# EAGLE design Arduino Mega DRAM Tester Shield (EAGLE 9.5.2)
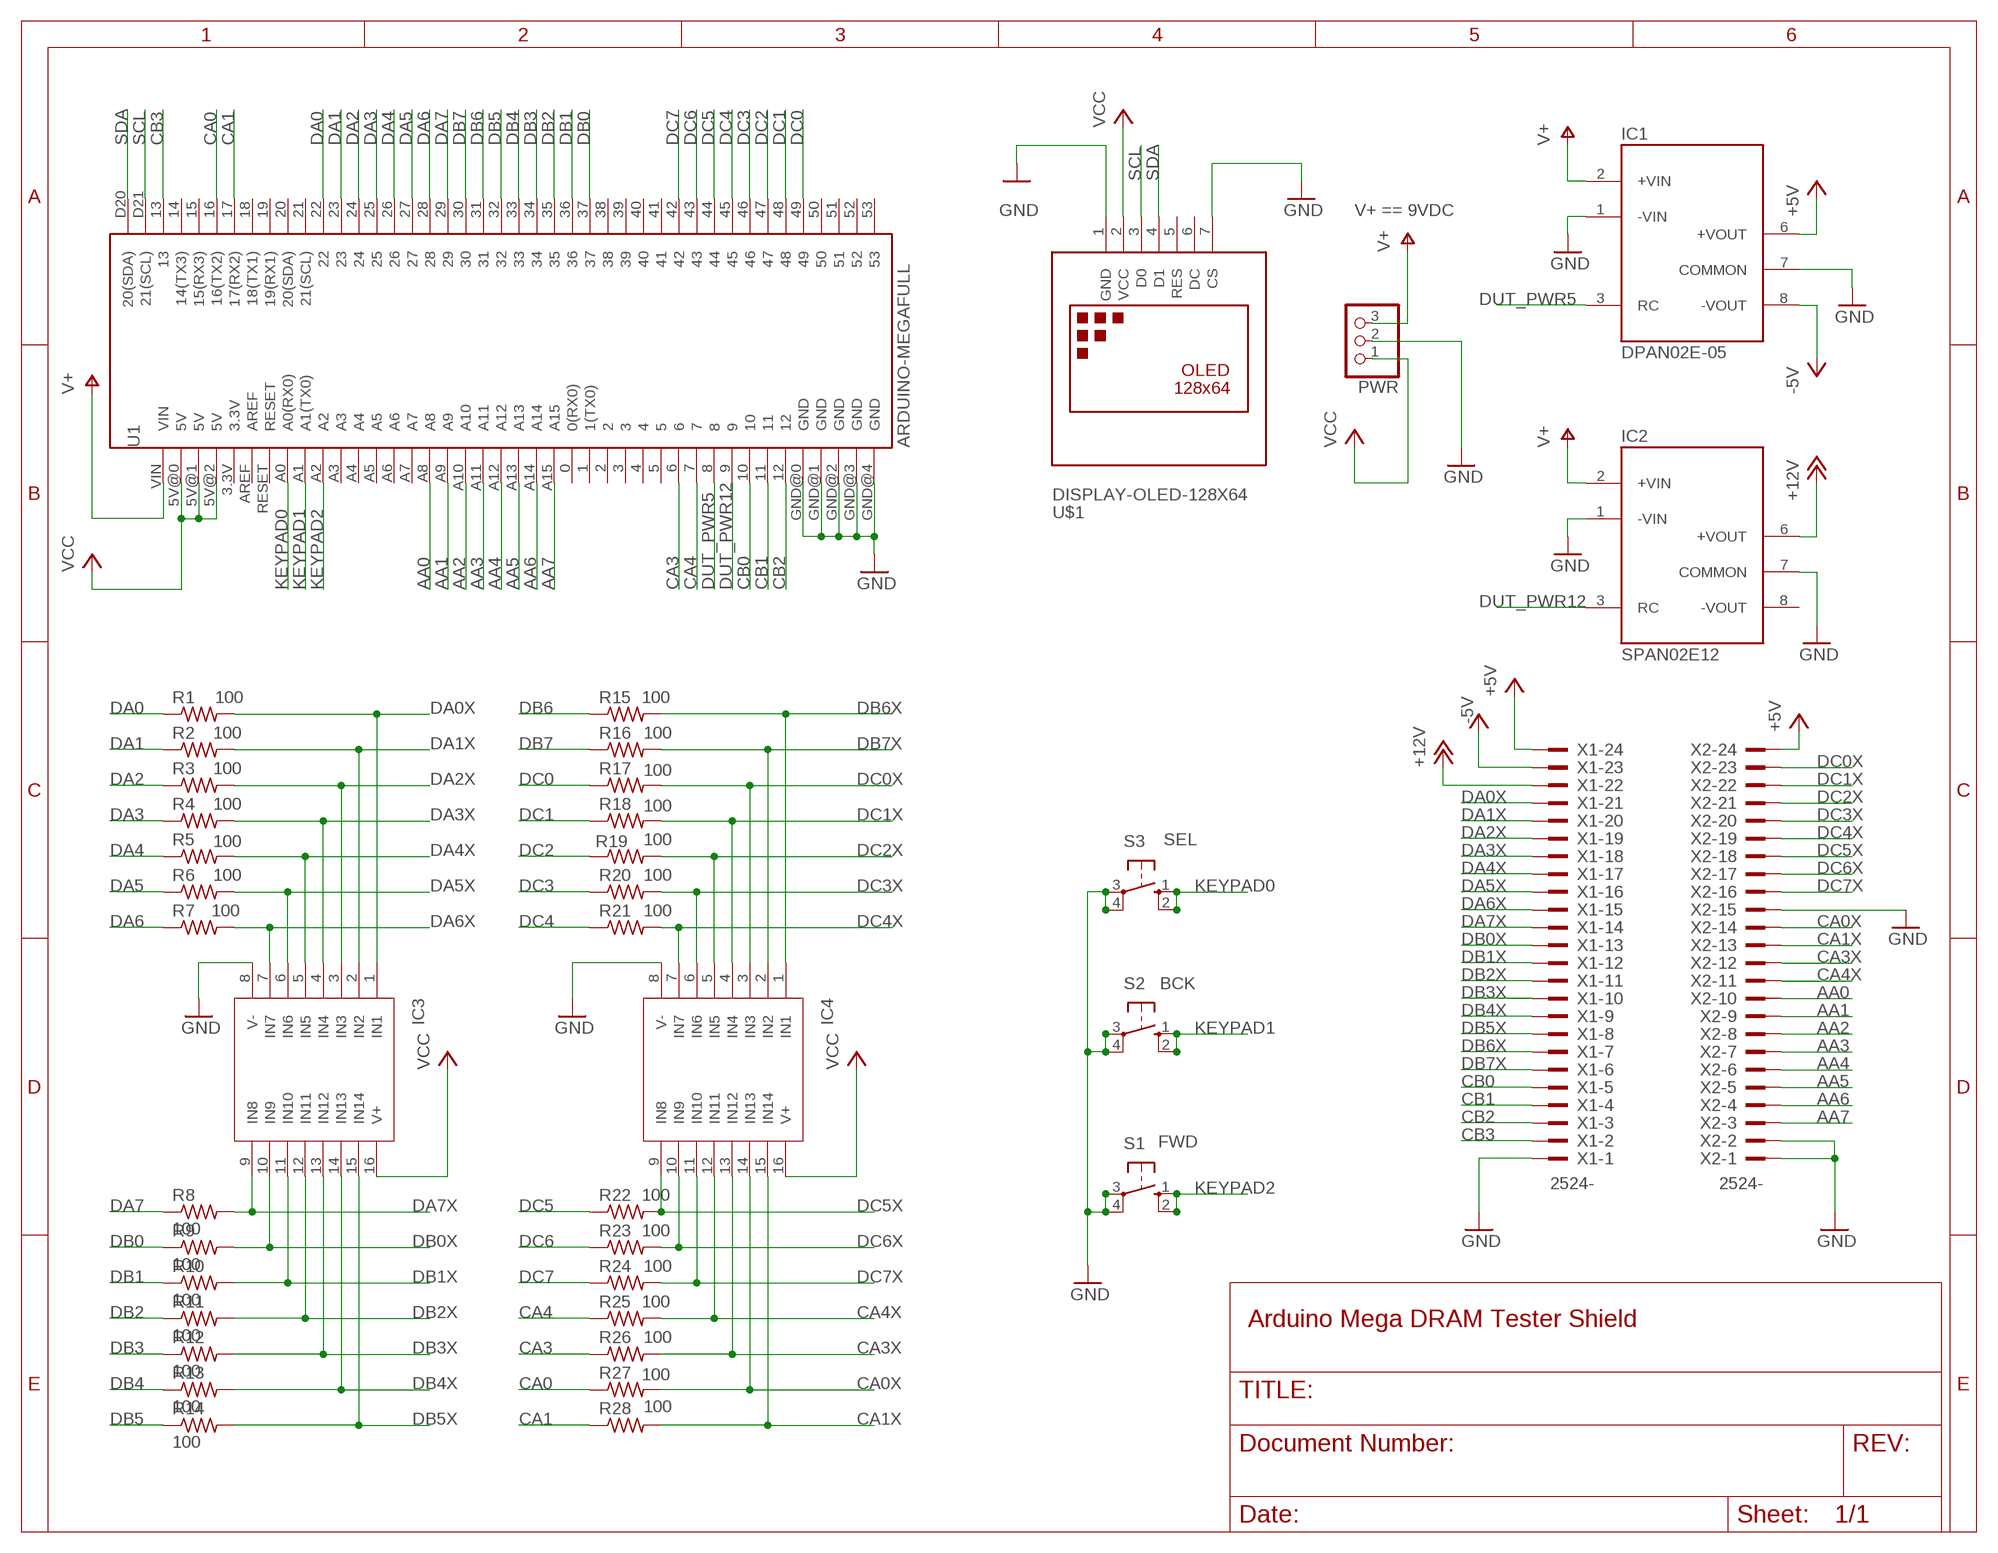
[diagram p0: schematic, sheet 1]

## Parts
IC1  DPAN02E-05  DPAN02  [SIP7]
IC2  SPAN02E12  DPAN02  [SIP7]
IC3  SP720  [DIL16]
IC4  SP720  [DIL16]
PWR  PINHD-1X3  [1X03]
R1  100  R-US_0204/7  [0204/7]
R2  100  R-US_0204/7  [0204/7]
R3  100  R-US_0204/7  [0204/7]
R4  100  R-US_0204/7  [0204/7]
R5  100  R-US_0204/7  [0204/7]
R6  100  R-US_0204/7  [0204/7]
R7  100  R-US_0204/7  [0204/7]
R8  100  R-US_0204/7  [0204/7]
R9  100  R-US_0204/7  [0204/7]
R10  100  R-US_0204/7  [0204/7]
R11  100  R-US_0204/7  [0204/7]
R12  100  R-US_0204/7  [0204/7]
R13  100  R-US_0204/7  [0204/7]
R14  100  R-US_0204/7  [0204/7]
R15  100  R-US_0204/7  [0204/7]
R16  100  R-US_0204/7  [0204/7]
R17  100  R-US_0204/7  [0204/7]
R18  100  R-US_0204/7  [0204/7]
R19  100  R-US_0204/7  [0204/7]
R20  100  R-US_0204/7  [0204/7]
R21  100  R-US_0204/7  [0204/7]
R22  100  R-US_0204/7  [0204/7]
R23  100  R-US_0204/7  [0204/7]
R24  100  R-US_0204/7  [0204/7]
R25  100  R-US_0204/7  [0204/7]
R26  100  R-US_0204/7  [0204/7]
R27  100  R-US_0204/7  [0204/7]
R28  100  R-US_0204/7  [0204/7]
S1  FWD  10-XX  [B3F-10XX]
S2  BCK  10-XX  [B3F-10XX]
S3  SEL  10-XX  [B3F-10XX]
U1  ARDUINO-MEGAFULL  [ARDUINO_MEGA]
U$1  DISPLAY-OLED-128X64  [DISPLAY-OLED-128X64]
X1  2524-  [PAK100/2500-24]
X2  2524-  [PAK100/2500-24]

## Nets
+5V: IC1.6(+VOUT) X1.24 X2.24
+12V: IC2.6(+VOUT) X1.22
-5V: IC1.8(-VOUT) X1.23
AA0: U1.A8 X2.10
AA1: U1.A9 X2.9
AA2: U1.A10 X2.8
AA3: U1.A11 X2.7
AA4: U1.A12 X2.6
AA5: U1.A13 X2.5
AA6: U1.A14 X2.4
AA7: U1.A15 X2.3
CA0: R27.1 U1.16(16(TX2))
CA0X: IC4.14(IN13) R27.2 X2.14
CA1: R28.1 U1.17(17(RX2))
CA1X: IC4.15(IN14) R28.2 X2.13
CA3: R26.1 U1.6
CA3X: IC4.13(IN12) R26.2 X2.12
CA4: R25.1 U1.7
CA4X: IC4.12(IN11) R25.2 X2.11
CB0: U1.10 X1.5
CB1: U1.11 X1.4
CB2: U1.12 X1.3
CB3: U1.13 X1.2
DA0: R1.1 U1.22
DA0X: IC3.1(IN1) R1.2 X1.21
DA1: R2.1 U1.23
DA1X: IC3.2(IN2) R2.2 X1.20
DA2: R3.1 U1.24
DA2X: IC3.3(IN3) R3.2 X1.19
DA3: R4.1 U1.25
DA3X: IC3.4(IN4) R4.2 X1.18
DA4: R5.1 U1.26
DA4X: IC3.5(IN5) R5.2 X1.17
DA5: R6.1 U1.27
DA5X: IC3.6(IN6) R6.2 X1.16
DA6: R7.1 U1.28
DA6X: IC3.7(IN7) R7.2 X1.15
DA7: R8.1 U1.29
DA7X: IC3.9(IN8) R8.2 X1.14
DB0: R9.1 U1.37
DB0X: IC3.10(IN9) R9.2 X1.13
DB1: R10.1 U1.36
DB1X: IC3.11(IN10) R10.2 X1.12
DB2: R11.1 U1.35
DB2X: IC3.12(IN11) R11.2 X1.11
DB3: R12.1 U1.34
DB3X: IC3.13(IN12) R12.2 X1.10
DB4: R13.1 U1.33
DB4X: IC3.14(IN13) R13.2 X1.9
DB5: R14.1 U1.32
DB5X: IC3.15(IN14) R14.2 X1.8
DB6: R15.1 U1.31
DB6X: IC4.1(IN1) R15.2 X1.7
DB7: R16.1 U1.30
DB7X: IC4.2(IN2) R16.2 X1.6
DC0: R17.1 U1.49
DC0X: IC4.3(IN3) R17.2 X2.23
DC1: R18.1 U1.48
DC1X: IC4.4(IN4) R18.2 X2.22
DC2: R19.1 U1.47
DC2X: IC4.5(IN5) R19.2 X2.21
DC3: R20.1 U1.46
DC3X: IC4.6(IN6) R20.2 X2.20
DC4: R21.1 U1.45
DC4X: IC4.7(IN7) R21.2 X2.19
DC5: R22.1 U1.44
DC5X: IC4.9(IN8) R22.2 X2.18
DC6: R23.1 U1.43
DC6X: IC4.10(IN9) R23.2 X2.17
DC7: R24.1 U1.42
DC7X: IC4.11(IN10) R24.2 X2.16
DUT_PWR5: IC1.3(RC) U1.8
DUT_PWR12: IC2.3(RC) U1.9
GND: IC1.1(-VIN) IC1.7(COMMON) IC2.1(-VIN) IC2.7(COMMON) IC3.8(V-) IC4.8(V-) PWR.2 S1.3(P) S1.4(P1) S2.3(P) S2.4(P1) S3.3(P) S3.4(P1) U1.GND@0(GND) U1.GND@1(GND) U1.GND@2(GND) U1.GND@3(GND) U1.GND@4(GND) U$1.1(GND) U$1.7(CS) X1.1 X2.1 X2.2 X2.15
KEYPAD0: S3.1(S) S3.2(S1) U1.A0(A0(RX0))
KEYPAD1: S2.1(S) S2.2(S1) U1.A1(A1(TX0))
KEYPAD2: S1.1(S) S1.2(S1) U1.A2
SCL: U1.D21(21(SCL)) U$1.3(D0)
SDA: U1.D20(20(SDA)) U$1.4(D1)
V+: IC1.2(+VIN) IC2.2(+VIN) PWR.3 U1.VIN
VCC: IC3.16(V+) IC4.16(V+) PWR.1 U1.5V@0(5V) U1.5V@1(5V) U1.5V@2(5V) U$1.2(VCC)
Unconnected: IC2.8(-VOUT) U1.0(0(RX0)) U1.1(1(TX0)) U1.2 U1.3 U1.3.3V U1.4 U1.5 U1.14(14(TX3)) U1.15(15(RX3)) U1.18(18(TX1)) U1.19(19(RX1)) U1.20(20(SDA)) U1.21(21(SCL)) U1.38 U1.39 U1.40 U1.41 U1.50 U1.51 U1.52 U1.53 U1.A3 U1.A4 U1.A5 U1.A6 U1.A7 U1.AREF U1.RESET U$1.5(RES) U$1.6(DC)

## Notes on the sheet
- V+ == 9VDC

## Library data of the parts
IC1 IC2 = MW DPAN02:DPAN02
IC3 IC4 = Littlefuse:SP720
PWR = pinhead:PINHD-1X3: PIN HEADER
R1-R28 = resistor:R-US_: RESISTOR, American symbol
S1-S3 = switch-omron:10-XX: OMRON SWITCH; MPN: B3F-1000; OC_FARNELL: 176432; OC_NEWARK: 36M3542
U1 = SparkFun-Boards:ARDUINO-MEGA: Arduino Mega board footprint
U$1 = Soigeneris:DISPLAY-OLED-128X64: 128x64 Dot Matrix OLED Module based on SSD1306 chip Variant with SPI interface More details available here: http://www.instructables.com/id/How-to-use-OLED-display-arduino-module/ SSD1306 datasheet: https://cdn-shop.adafruit.com/datasheets/SSD1306.pdf Click here to find device on ebay.com <http://www.ebay.com/sch/oled+display+128x64> Note: There are two variants: I2C and SPI. Search for the proper version.
X1 X2 = con-3m:2524-: 3M (TM) Pak 100 4-Wall Header Source: 3M; OC_FARNELL: unknown; OC_NEWARK: unknown

## Board
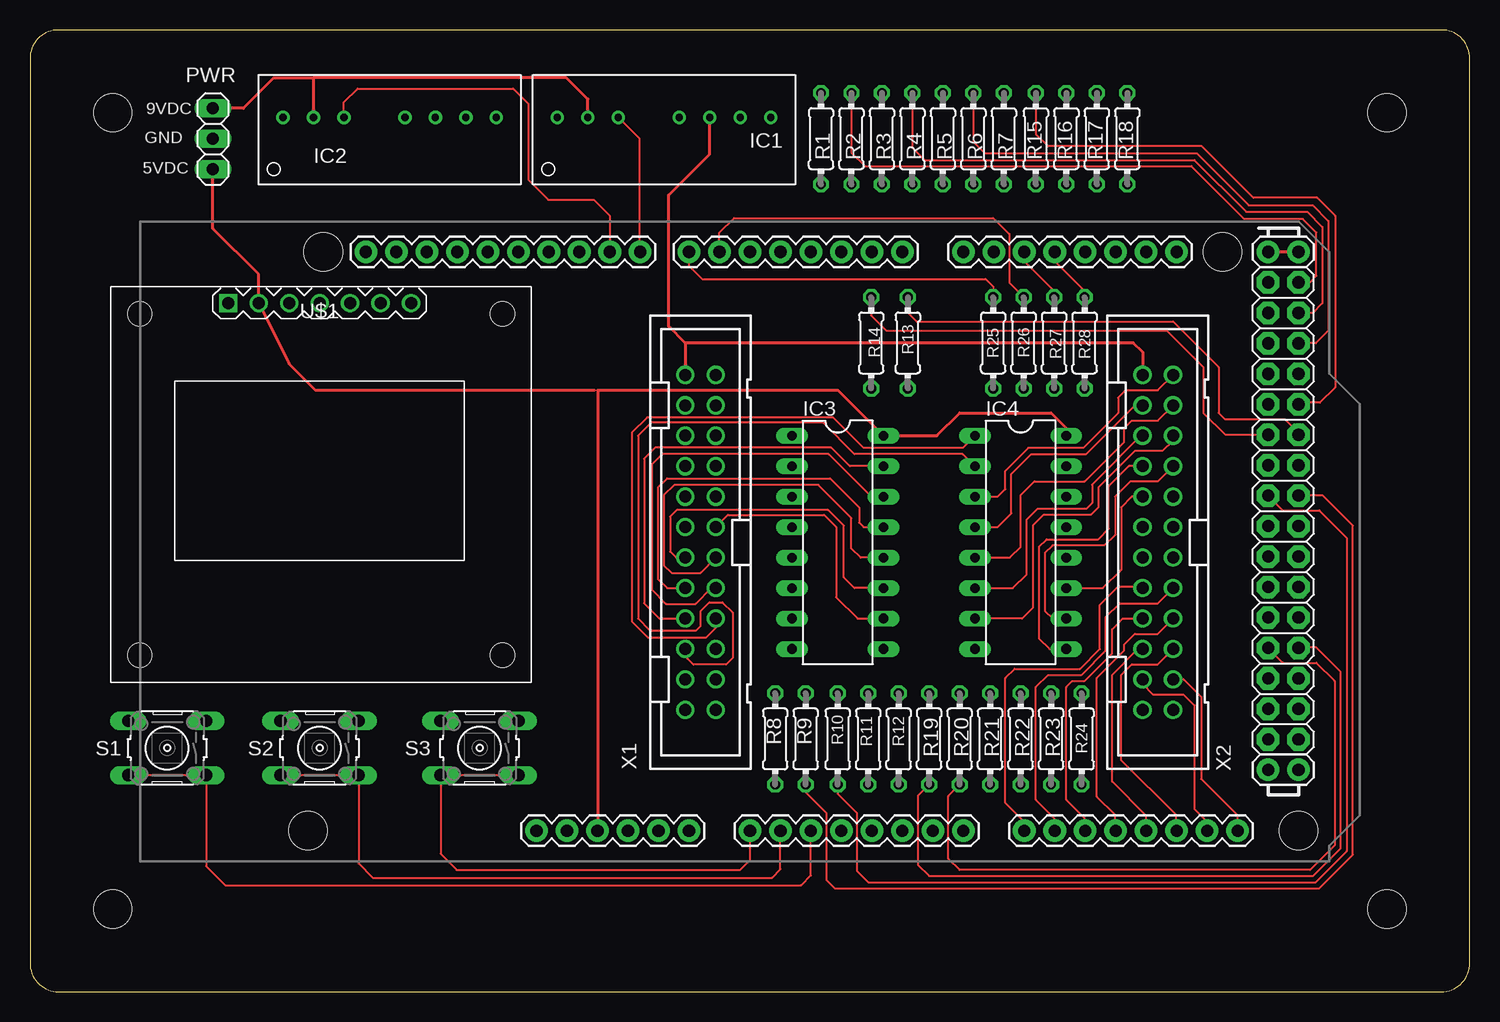
[diagram p1: board, top side]
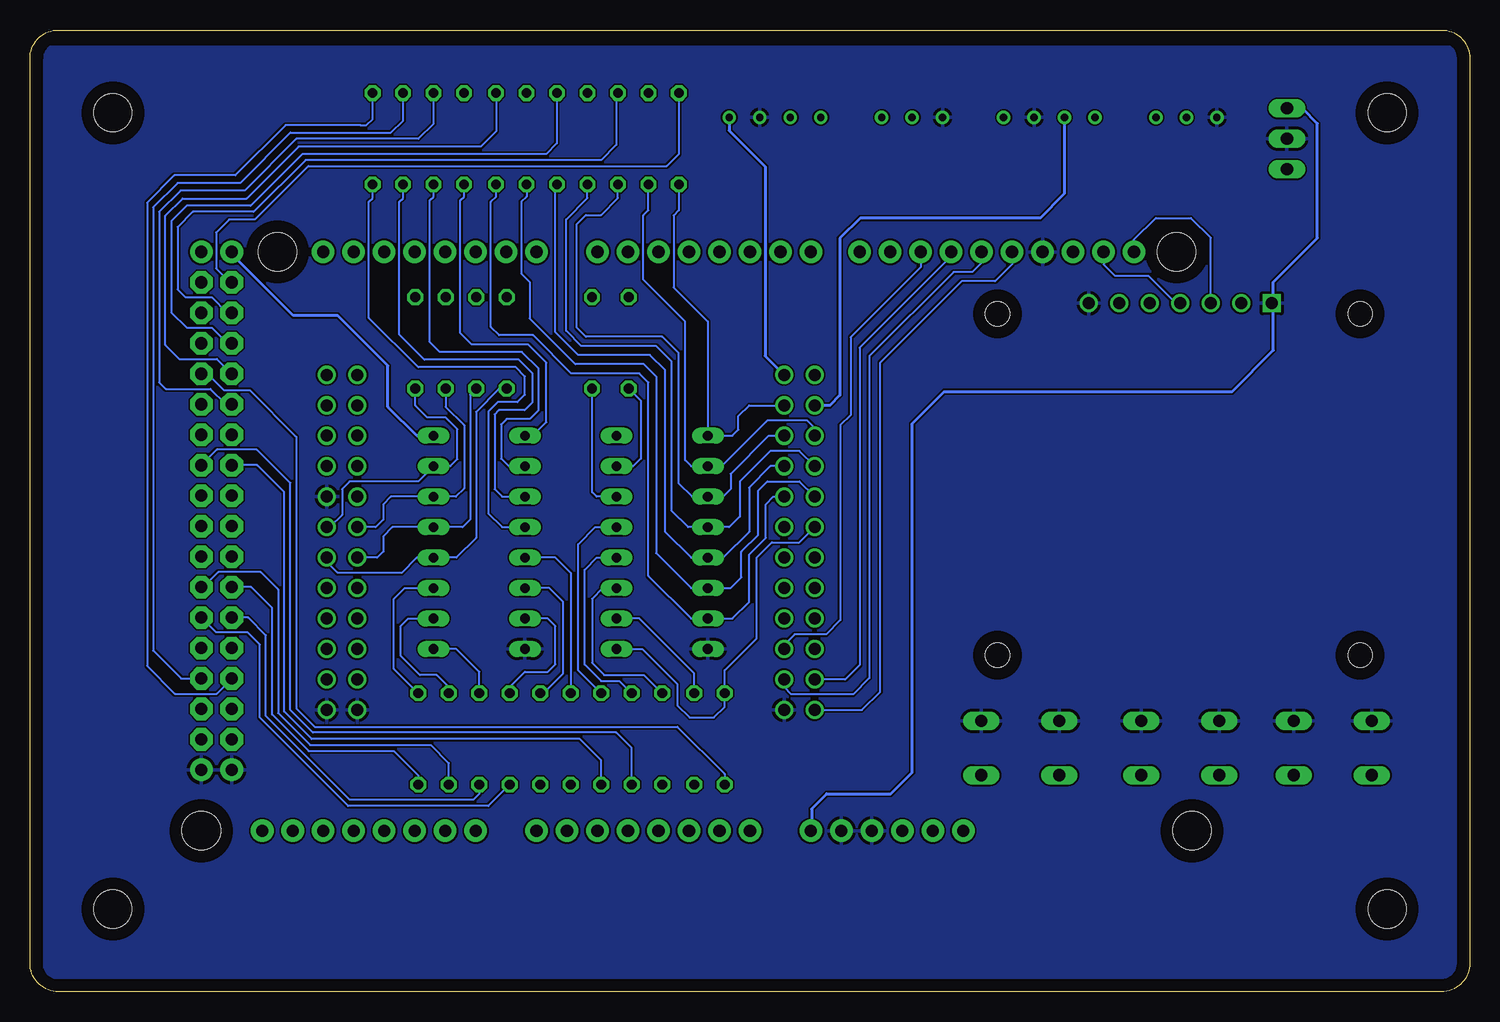
[diagram p2: board, bottom side, seen from below]

Size 119.99 x 80.19 mm. Coordinates in mm from the lower left corner, seen from the top.
Outline: 0,77.81 0,2.38 arc90 2.38,0 117.61,0 arc90 119.99,2.38 119.99,77.81 arc90 117.61,80.19 2.38,80.19 arc90 0,77.81
Copper layers (1*16): Top 0.035mm / dielectric 1.5mm / Bottom 0.035mm
Design rules "default": minimum track width 6mil, minimum drill 0.35mm, track to track 6mil, track to pad 6mil, pad to pad 6mil, via to via 6mil, smd to smd 6mil, copper to edge 40mil, drill to drill 6mil, minimum pad ring 10mil, minimum via ring 8mil, stop-mask expansion 4mil, vias tented up to drill 0mil, thermal gap 10mil
Holes 3.17 mm at 6.89,73.29 113.09,73.29 113.09,6.89 6.89,6.89

### Footprints (pad centres in the part's own frame; a part is rotated, then mirrored left to right if it is on the bottom)
SIP7 = drill 0.6: 1 2.032,5.588; 2 4.572,5.588; 3 7.112,5.588; 5 12.192,5.588; 6 14.732,5.588; 7 17.272,5.588; 8 19.812,5.588
DIL16 = drill 0.813 long: 1 -8.89,-3.81; 2 -6.35,-3.81; 3 -3.81,-3.81; 4 -1.27,-3.81; 5 1.27,-3.81; 6 3.81,-3.81; 7 6.35,-3.81; 8 8.89,-3.81; 9 8.89,3.81; 10 6.35,3.81; 11 3.81,3.81; 12 1.27,3.81; 13 -1.27,3.81; 14 -3.81,3.81; 15 -6.35,3.81; 16 -8.89,3.81
1X03 = drill 1.016 long: 1 -2.54,0; 2 0,0; 3 2.54,0
0204/7 = drill 0.813 octagon: 1 -3.81,0; 2 3.81,0
B3F-10XX = drill 1.016 long: 1 -3.251,2.261; 2 3.251,2.261; 3 -3.251,-2.261; 4 3.251,-2.261
ARDUINO_MEGA = drill 1.016 pad 1.88: 0 63.5,50.8; 1 60.96,50.8; 2 58.42,50.8; 3 55.88,50.8; 3.3V 35.56,2.54; 4 53.34,50.8; 5 50.8,50.8; 5V@0 38.1,2.54; 5V@1 93.98,50.8; 5V@2 96.52,50.8; 6 48.26,50.8; 7 45.72,50.8; 8 41.656,50.8; 9 39.116,50.8; 10 36.576,50.8; 11 34.036,50.8; 12 31.496,50.8; 13 28.956,50.8; 14 68.58,50.8; 15 71.12,50.8; 16 73.66,50.8; 17 76.2,50.8; 18 78.74,50.8; 19 81.28,50.8; 20 83.82,50.8; 21 86.36,50.8; A0 50.8,2.54; A1 53.34,2.54; A2 55.88,2.54; A3 58.42,2.54; A4 60.96,2.54; A5 63.5,2.54; A6 66.04,2.54; A7 68.58,2.54; A8 73.66,2.54; A9 76.2,2.54; A10 78.74,2.54; A11 81.28,2.54; A12 83.82,2.54; A13 86.36,2.54; A14 88.9,2.54; A15 91.44,2.54; AREF 23.876,50.8; D20 21.336,50.8; D21 18.796,50.8; GND@0 40.64,2.54; GND@1 43.18,2.54; GND@2 93.98,7.62; GND@3 96.52,7.62; GND@4 26.416,50.8; RESET 33.02,2.54; VIN 45.72,2.54 | drill 1.016 pad 1.88 octagon: 22 93.98,48.26; 23 96.52,48.26; 24 93.98,45.72; 25 96.52,45.72; 26 93.98,43.18; 27 96.52,43.18; 28 93.98,40.64; 29 96.52,40.64; 30 93.98,38.1; 31 96.52,38.1; 32 93.98,35.56; 33 96.52,35.56; 34 93.98,33.02; 35 96.52,33.02; 36 93.98,30.48; 37 96.52,30.48; 38 93.98,27.94; 39 96.52,27.94; 40 93.98,25.4; 41 96.52,25.4; 42 93.98,22.86; 43 96.52,22.86; 44 93.98,20.32; 45 96.52,20.32; 46 93.98,17.78; 47 96.52,17.78; 48 93.98,15.24; 49 96.52,15.24; 50 93.98,12.7; 51 96.52,12.7; 52 93.98,10.16; 53 96.52,10.16 | hole 3.2: 15.24,50.8; 13.97,2.54; 90.17,50.8; 96.52,2.54
DISPLAY-OLED-128X64 = drill 1 square: 1 -7.62,15.24 | drill 1: 2 -5.08,15.24; 3 -2.54,15.24; 4 0,15.24; 5 2.54,15.24; 6 5.08,15.24; 7 7.62,15.24 | hole 2: -14.986,14.351; 15.24,14.351; 15.24,-14.097; -14.986,-14.097
PAK100/2500-24 = drill 1 pad 1.422: 1 -13.97,-1.27; 2 -13.97,1.27; 3 -11.43,-1.27; 4 -11.43,1.27; 5 -8.89,-1.27; 6 -8.89,1.27; 7 -6.35,-1.27; 8 -6.35,1.27; 9 -3.81,-1.27; 10 -3.81,1.27; 11 -1.27,-1.27; 12 -1.27,1.27; 13 1.27,-1.27; 14 1.27,1.27; 15 3.81,-1.27; 16 3.81,1.27; 17 6.35,-1.27; 18 6.35,1.27; 19 8.89,-1.27; 20 8.89,1.27; 21 11.43,-1.27; 22 11.43,1.27; 23 13.97,-1.27; 24 13.97,1.27

### Placement (x,y rotation side)
IC1  41.91,67.31 0 top
IC2  19.05,67.31 0 top
IC3  67.31,37.47 270 top
IC4  82.55,37.47 270 top
PWR  15.24,71.12 90 top
R1  65.91,71.12 270 top
R2  68.45,71.12 270 top
R3  70.99,71.12 270 top
R4  73.53,71.12 270 top
R5  76.07,71.12 270 top
R6  78.61,71.12 270 top
R7  81.15,71.12 270 top
R8  62.1,21.08 90 top
R9  64.64,21.08 90 top
R10  67.31,21.08 90 top
R11  69.85,21.08 90 top
R12  72.39,21.08 90 top
R13  73.15,54.1 270 top
R14  70.1,54.1 270 top
R15  83.82,71.12 270 top
R16  86.36,71.12 270 top
R17  88.9,71.12 270 top
R18  91.44,71.12 270 top
R19  74.93,21.08 90 top
R20  77.47,21.08 90 top
R21  80.01,21.08 90 top
R22  82.55,21.08 90 top
R23  85.09,21.08 90 top
R24  87.63,21.08 90 top
R25  80.26,54.1 270 top
R26  82.8,54.1 270 top
R27  85.34,54.1 270 top
R28  87.88,54.1 270 top
S1  11.43,20.32 180 top
S2  24.13,20.32 180 top
S3  37.47,20.32 180 top
U1  9.19,10.88 0 top
U$1  24.13,42.16 0 top
X1  55.88,37.47 90 top
X2  93.98,37.47 90 top

### Tracks (layer width: path | path; a pad name or v marks a point on that pad's centre or on a via)
+5V
  Top 0.254: 54.61,54.1 X1.24 | X2.24 92.71,53.34 91.95,54.1 54.61,54.1 | IC1.6 56.64,69.85 53.21,66.42 53.21,55.5 54.61,54.1
+12V
  Bottom 0.254: IC2.6 33.78,66.55 35.81,64.52 50.8,64.52 52.5,62.81 52.5,49.73 53.34,48.9 X1.22
-5V
  Bottom 0.254: X1.23 58.73,53.01 58.73,68.8 61.72,71.8 IC1.8
AA0
  Top 0.152: U1.A8 82.86,14.17 81.28,15.75 81.28,26.16 82.04,26.92 87.5,26.92 89.15,28.57 89.15,32.26 90.68,33.78 92.58,33.78 X2.10
AA1
  Top 0.152: U1.A9 85.39,14.43 83.82,16 83.82,25.4 84.84,26.42 87.63,26.42 89.66,28.45 89.66,31.24 90.81,32.38 93.98,32.38 X2.9
AA2
  Top 0.152: U1.A10 87.88,13.47 87.88,14.48 86.36,16 86.36,25.4 86.87,25.91 87.88,25.91 90.17,28.19 90.17,30.23 91.06,31.11 X2.8
AA3
  Top 0.152: U1.A11 90.42,13.47 90.42,14.73 88.9,16.26 88.9,26.16 91.19,28.45 91.19,28.96 92.08,29.84 93.98,29.84 X2.7
AA4
  Top 0.152: U1.A12 93.02,14.68 90.17,17.53 90.17,26.42 92.33,28.57 X2.6
AA5
  Top 0.152: U1.A13 95.5,13.47 95.5,14.73 90.93,19.3 90.93,26.42 91.82,27.3 93.98,27.3 X2.5
AA6
  Top 0.152: U1.A14 98.09,14.19 97.03,15.25 97.03,23.88 96.14,24.77 93.6,24.77 92.71,25.65 X2.4
AA7
  Top 0.152: U1.A15 100.64,14.69 97.59,17.74 97.59,24.59 96.14,26.04 X2.3
CA0
  Top 0.152: U1.16 82.86,60.88 82.87,60.9 85.34,58.42 R27.1
CA0X
  Bottom 0.152: R27.2 85.34,48.77 83.82,47.24 83.82,41.96 84.51,41.27 IC4.14 89.92,41.27 90.55,40.64 90.55,39.37 91.19,38.73 X2.14
CA1
  Top 0.152: U1.17 85.39,60.91 87.88,58.42 R28.1
CA1X
  Bottom 0.152: R28.2 87.88,48.9 86.87,47.88 85.34,47.88 84.38,46.91 84.38,44.4 84.96,43.81 IC4.15 87.63,42.55 93.34,42.55 93.98,41.91 93.98,39.75 95,38.73 X2.13
CA3
  Top 0.152: R26.1 81.61,59.11 81.61,63.17 80.26,64.52 58.67,64.52 57.45,63.3 U1.6
CA3X
  Bottom 0.152: R26.2 83.31,49.78 83.31,39.37 83.95,38.73 IC4.13 89.79,38.73 90.55,37.97 90.55,36.7 91.06,36.2 X2.12
CA4
  Top 0.152: U1.7 54.91,60.53 56.01,59.44 79.63,59.44 80.26,58.8 R25.1
CA4X
  Bottom 0.152: R25.2 80.89,50.29 82.8,48.35 82.8,37.85 84.45,36.2 IC4.12 87.76,36.2 89.03,34.92 94.36,34.92 95.25,35.81 X2.11
CB0
  Bottom 0.152: U1.10 45.77,60.41 51.61,54.57 51.61,48.08 52.45,47.24 52.45,30.99 53.63,29.81 56.26,29.81 57.15,28.92 X1.5
CB1
  Bottom 0.152: U1.11 43.23,61.33 50.86,53.7 50.86,27.25 52.07,26.04 X1.4
CB2
  Bottom 0.152: X1.3 57.15,25.4 56.55,24.8 51.4,24.8 50.04,26.16 50.04,53 43.03,60 41.47,60 40.69,60.78 U1.12
CB3
  Bottom 0.152: U1.13 38.15,60.66 39.56,59.24 42.36,59.24 49.15,52.45 49.15,25.02 50.67,23.5 X1.2
DA0
  Bottom 0.152: R1.1 65.91,69.85 66.93,68.83 96.79,68.83 101.25,64.38 103.41,64.38 104.47,63.31 104.47,60.31 103.3,59.14 U1.22
DA0X
  Bottom 0.152: X1.21 60.07,48.9 60.96,48.01 60.96,46.86 61.47,46.35 IC3.1 63.5,55.88 66.34,58.73 66.34,64.72 65.91,65.15 R1.2
DA1
  Top 0.152: R2.1 68.45,69.98 69.6,68.83 96.77,68.83 101.18,64.43 106.07,64.43 107.19,63.31 107.19,59.69 106.64,59.14 U1.23
DA1X
  Bottom 0.152: X1.20 54.61,46.99 55.28,47.66 58.51,47.66 62.36,43.81 IC3.2 64.9,43.81 65.41,44.32 65.41,55.88 68.89,59.36 68.89,64.73 68.45,65.17 R2.2
DA2
  Bottom 0.152: R3.1 71.12,74.8 71.12,70.61 72.39,69.34 97.03,69.34 101.35,65.02 106.43,65.02 107.7,63.75 107.7,58.55 107.05,57.9 104.85,57.9 103.55,56.6 U1.24
DA2X
  Bottom 0.152: X1.19 58.42,46.35 61.59,43.18 61.59,41.91 62.23,41.27 IC3.3 64.82,41.27 65.94,42.39 65.94,53.24 67.31,54.61 73.66,54.61 74.42,55.37 74.42,64.01 73.66,64.77 72.39,64.77 70.99,66.17 R3.2
DA3
  Top 0.152: R4.1 73.53,70.36 74.55,69.34 97.03,69.34 101.35,65.02 106.43,65.02 107.7,63.75 107.7,57.4 106.9,56.6 U1.25
DA3X
  Bottom 0.152: X1.18 55.88,45.09 58.29,45.09 60.83,42.55 60.83,39.62 61.72,38.73 IC3.4 65.15,38.73 66.55,40.13 66.55,52.58 67.82,53.85 74.04,53.85 75.31,55.12 75.31,64.39 73.53,66.17 R4.2
DA4
  Bottom 0.152: R5.1 76.07,70.74 76.96,69.85 97.28,69.85 101.6,65.53 106.93,65.53 108.2,64.26 108.2,56.64 106.92,55.36 104.85,55.36 103.55,54.06 U1.26
DA4X
  Bottom 0.152: X1.17 58.29,43.81 60.07,42.04 60.07,38.35 62.23,36.2 IC3.5 64.9,36.2 67.06,38.35 67.06,51.82 68.33,53.09 74.3,53.09 76.2,54.99 76.2,67.18 R5.2
DA5
  Top 0.152: R6.1 78.61,70.87 79.58,69.9 97.23,69.9 101.55,65.58 106.88,65.58 108.2,64.26 108.2,55.12 107.15,54.06 U1.27
DA5X
  Bottom 0.152: X1.16 55.88,42.55 58.55,42.55 59.31,41.78 59.31,38.1 60.71,36.7 60.71,34.54 61.59,33.66 IC3.6 64.9,33.66 67.82,36.58 67.82,51.31 68.83,52.32 74.55,52.32 78.36,56.13 78.36,59.18 79.05,59.87 79.05,65.86 78.61,66.29 R6.2
DA6
  Bottom 0.152: R7.1 81.15,71.73 82.42,70.46 97.61,70.46 101.93,66.14 107.26,66.14 108.71,64.69 108.71,53.92 107.56,52.77 104.42,52.77 U1.28
DA6X
  Bottom 0.152: X1.15 58.04,41.27 58.67,40.64 58.67,37.85 60.07,36.45 60.07,32.51 61.47,31.11 IC3.7 64.9,31.11 68.45,34.67 68.45,50.8 69.22,51.56 74.88,51.56 78.05,54.74 80.9,54.74 81.58,55.42 81.58,65.86 81.15,66.29 R7.2
DA7
  Bottom 0.152: U1.29 105.21,51.52 103.83,50.15 101.67,50.15 97.79,46.27 97.79,23.62 96.27,22.1 66.04,22.1 62.1,18.16 R8.1
DA7X
  Bottom 0.152: IC3.9 68.96,28.57 66.04,25.65 66.04,23.88 65.02,22.86 62.99,22.86 62.1,23.75 R8.2 62.1,26.8 59.44,29.46 59.44,36.2 58.17,37.47 55.88,37.47 X1.14
DB0
  Top 0.152: R9.1 64.64,16.64 66.37,14.91 66.37,9.32 67.06,8.64 107.44,8.64 110.24,11.43 110.24,38.86 107.7,41.4 105.75,41.4 U1.37
DB0X
  Top 0.152: X1.13 58.17,39.75 66.17,39.75 67.18,38.73 67.18,32.89 68.96,31.11 IC3.10
  Bottom 0.152: IC3.10 69.22,31.11 64.64,26.54 R9.2
DB1
  Top 0.152: R10.1 67.31,16.51 68.91,14.91 68.91,10.08 69.85,9.14 107.15,9.14 109.73,11.72 109.73,37.85 107.44,40.13 104.39,40.13 104.39,40.15 U1.36
DB1X
  Top 0.152: IC3.11 68.71,33.66 67.82,34.54 67.82,38.86 66.52,40.16 53.88,40.16 53.34,39.62 53.34,36.7 53.85,36.2 X1.12
  Bottom 0.152: IC3.11 72.26,33.66 73.15,32.77 73.15,27.43 72.14,26.42 68.83,26.42 R10.2
DB2
  Bottom 0.152: R11.1 69.85,20.32 71.15,21.62 96.43,21.62 98.3,23.5 98.3,42.42 101.08,45.2 104.42,45.2 U1.35
DB2X
  Top 0.152: IC3.12 69.22,36.2 68.45,36.96 68.45,39.5 65.69,42.26 53.69,42.26 52.83,41.4 52.83,35.56 53.47,34.92 55.88,34.92 X1.11
  Bottom 0.152: R11.2 70.87,25.91 72.39,25.91 73.76,27.28 73.76,35.18 72.75,36.2 IC3.12
DB3
  Bottom 0.152: R12.1 72.39,19.3 74.17,21.08 96.52,21.08 98.81,23.37 98.81,41.66 101.05,43.9 U1.34
DB3X
  Top 0.152: X1.10 53.09,33.66 52.32,34.42 52.32,42.04 53.09,42.8 66.67,42.8 69.09,40.39 69.09,39.12 69.47,38.73 IC3.13
  Bottom 0.152: R12.2 72.4,24.89 74.32,26.81 74.32,37.31 72.9,38.73 IC3.13
DB4
  Top 0.152: R13.1 73.15,56.64 73.91,55.88 95.25,55.88 99.06,52.07 99.06,48.26 99.58,47.74 104.55,47.74 105.72,46.57 U1.33
DB4X
  Top 0.152: IC3.14 70.1,41.27 66.55,44.83 52.7,44.83 51.82,43.94 51.82,33.53 52.99,32.35 55.47,32.35 56.77,33.66 X1.9
  Bottom 0.152: IC3.14 72.77,41.27 73.15,41.66 R13.2
DB5
  Top 0.152: R14.1 70.1,56.39 71.37,55.12 94.74,55.12 97.79,52.07 97.79,48.26 99.61,46.44 U1.32
DB5X
  Top 0.152: IC3.15 68.33,43.81 66.77,45.37 52.1,45.37 51.18,44.45 51.18,32.38 52.45,31.11 X1.8
  Bottom 0.152: R14.2 69.09,49.28 69.09,44.45 69.72,43.81 IC3.15
DB6
  Top 0.152: R15.1 83.82,71.5 84.84,70.48 97.65,70.48 101.94,66.19 107.26,66.19 108.76,64.69 108.76,50.38 107.49,49.11 105.84,49.11 U1.31
DB6X
  Top 0.152: IC4.1 77.72,45.34 69.47,45.34 66.93,47.88 51.44,47.88 50.16,46.61 50.16,30.86 51.47,29.56 56.35,29.56 57.15,30.35 X1.7
  Bottom 0.152: IC4.1 78.11,46.35 76.96,47.5 76.96,52.45 78.49,53.98 83.19,53.98 84.12,54.91 84.12,65.99 83.82,66.29 R15.2
DB7
  Bottom 0.152: U1.30 103.68,48.98 104.95,50.25 108.67,50.25 109.22,50.8 109.22,65.02 107.44,66.8 102.11,66.8 97.79,71.12 87.63,71.12 86.36,72.39 R16.1
DB7X
  Top 0.152: IC4.2 77.72,44.83 68.71,44.83 66.09,47.45 51.77,47.45 50.67,46.35 50.67,31.11 51.66,30.13 55.53,30.13 55.88,30.48 55.88,31.75 56.61,32.48 57.69,32.48 58.55,31.62 58.55,27.81 58.01,27.27 55.28,27.27 54.61,27.94 X1.6
  Bottom 0.152: IC4.2 80.09,43.81 80.72,44.45 80.72,47.3 80.26,47.75 78.36,47.75 77.6,48.51 77.6,51.94 78.99,53.34 85.85,53.34 86.67,54.15 86.67,65.99 86.36,66.29 R16.2
DC0
  Bottom 0.152: U1.49 107.4,26.12 109.73,28.45 109.73,65.41 107.7,67.44 102.49,67.44 98.3,71.63 89.92,71.63 88.9,72.64 R17.1
DC0X
  Top 0.152: IC4.3 80.64,41.27 81.28,41.91 81.28,43.43 83.19,45.34 87.76,45.34 90.68,48.26 90.68,49.53 91.31,50.16 93.98,50.16 X2.23
  Bottom 0.152: IC4.3 80.64,41.27 81.28,41.91 81.28,48.13 80.92,48.49 78.77,48.49 78.11,49.16 78.11,51.56 79.25,52.7 87.12,52.7 89.2,54.79 89.2,65.88 88.9,66.18 R17.2
DC1
  Bottom 0.152: U1.48 104.44,24.85 107.91,24.85 110.24,27.18 110.24,65.79 107.95,68.07 102.87,68.07 98.68,72.26 92.71,72.26 92.46,72.26 91.95,72.26 91.44,72.77 R18.1
DC1X
  Top 0.152: IC4.4 80.64,38.73 81.79,39.88 81.79,43.18 83.44,44.83 88.01,44.83 92.08,48.9 X2.22
  Bottom 0.152: R18.2 91.44,66.17 91.75,65.86 91.75,56.19 87.63,52.07 79.5,52.07 78.74,51.31 78.74,49.78 79.38,49.15 81.03,49.15 81.79,48.39 81.79,39.88 80.64,38.73 IC4.4
DC2
  Top 0.152: R19.1 73.99,16.33 73.99,10.59 74.93,9.65 106.93,9.65 109.22,11.94 109.22,26.67 107.19,28.7 105.75,28.7 U1.47
DC2X
  Top 0.152: IC4.5 81.66,36.2 82.55,37.08 82.55,41.4 83.69,42.55 87.88,42.55 91.19,45.85 91.19,46.99 91.82,47.62 93.98,47.62 X2.21
  Bottom 0.152: R19.2 74.93,34.92 76.2,36.2 IC4.5
DC3
  Top 0.152: U1.46 104.41,27.43 107.19,27.43 108.71,25.91 108.71,12.19 106.68,10.16 77.47,10.16 76.53,11.1 76.53,16.33 R20.1
DC3X
  Top 0.152: X2.20 92.58,46.35 88.52,42.29 88.52,40.77 88.01,40.26 83.95,40.26 83.06,39.37 83.06,34.8 81.92,33.66 IC4.6
  Bottom 0.152: R20.2 77.22,24.89 75.56,26.54 75.56,32.51 76.71,33.66 IC4.6
DC4
  Bottom 0.152: R21.1 81.79,15.49 93.47,15.49 100.84,22.86 100.84,28.96 101.85,29.97 104.48,29.97 U1.45
DC4X
  Top 0.152: X2.19 95.25,45.97 94.36,45.09 92.08,45.09 89.03,42.04 89.03,40.39 88.39,39.75 84.45,39.75 83.57,38.86 83.57,32 82.68,31.11 IC4.7
  Bottom 0.152: R21.2 80.01,25.4 78.74,26.67 76.83,26.67 76.2,27.3 76.2,30.48 76.83,31.11 IC4.7
DC5
  Bottom 0.152: R22.1 82.55,16.51 83.06,16 93.34,16 100.33,22.99 100.33,29.72 101.82,31.2 U1.44
DC5X
  Top 0.152: IC4.9 84.96,28.57 84.07,29.46 84.07,37.08 84.71,37.72 89.03,37.72 89.92,38.61 89.92,42.16 91.57,43.81 X2.18
  Bottom 0.152: IC4.9 84.45,28.57 82.55,26.67 R22.2
DC6
  Bottom 0.152: R23.1 85.09,19.05 86.61,20.57 96.65,20.57 99.31,23.24 99.31,33.53 100.78,34.99 104.29,34.99 105.54,33.74 U1.43
DC6X
  Top 0.152: X2.17 93.98,42.55 91.69,42.55 90.42,41.27 90.42,38.1 89.53,37.21 85.22,37.21 84.58,36.58 84.58,31.75 85.22,31.11 IC4.10
  Bottom 0.152: R23.2 85.09,25.4 86.11,26.42 87.5,26.42 89.1,28.02 89.1,30.48 88.47,31.11 IC4.10
DC7
  Bottom 0.152: R24.1 87.63,18.03 89.66,20.07 96.77,20.07 99.82,23.11 99.82,32 101.56,33.74 U1.42
DC7X
  Top 0.152: X2.16 91.82,41.27 90.93,40.39 90.93,35.18 89.41,33.66 IC4.11
  Bottom 0.152: R24.2 89.66,26.92 89.66,32.77 88.77,33.66 IC4.11
DUT_PWR5
  Top 0.152: U1.8 50.8,61.73 50.8,71.12 IC1.3
DUT_PWR12
  Top 0.152: IC2.3 26.16,74.17 27.3,75.31 40.26,75.31 41.53,74.04 41.53,67.69 43.18,66.04 46.99,66.04 48.31,64.72 U1.9
GND
  pour Bottom: 0.64,78.74 118.75,78.74 118.75,0 0.64,0
KEYPAD0
  Top 0.152: U1.A0 59.99,10.97 59.18,10.16 35.54,10.16 35.54,10.18 34.21,11.51 S3.2 S3.1
KEYPAD1
  Top 0.152: U1.A1 62.53,10.21 61.84,9.51 28.56,9.51 27.38,10.69 S2.1 S2.2
KEYPAD2
  Top 0.152: U1.A2 65.08,9.7 64.26,8.89 16.26,8.89 14.68,10.46 S1.1 S1.2
SCL
  Bottom 0.152: U1.D21 27.99,62.7 26.18,64.52 23.24,64.52 21.59,62.87 U$1.3
SDA
  Bottom 0.152: U$1.4 24.51,57.4 26.8,59.69 29.59,59.69 30.53,60.63 U1.D20
V+
  Top 0.254: IC1.2 46.48,74.42 44.7,76.2 23.62,76.2 | 23.62,76.2 IC2.2 | PWR.3 17.78,73.66 20.32,76.2 23.62,76.2
  Bottom 0.254: U1.VIN 54.91,13.45 54.86,13.5 54.86,15.24 53.59,16.51 48.26,16.51 46.48,18.29 46.48,47.37 43.81,50.04 19.81,50.04 16.37,53.48 16.37,59.18 12.7,62.85 12.7,72.39 13.97,73.66 PWR.3
VCC
  Top 0.254: IC4.16 86.36,46.99 85.09,48.26 77.47,48.26 75.56,46.35 IC3.16 67.34,50.13 47.3,50.13 U1.5V@0 | 47.04,50.13 23.8,50.13 21.59,52.34 U$1.2 19.05,59.82 15.24,63.63 PWR.1 | U1.5V@2 U1.5V@1
  Bottom 0.152: U1.5V@1
  Bottom 0.254: IC4.16 87.76,46.35 90.17,48.77 90.17,52.2 94.36,56.39 98.04,56.39 103.17,61.52 U1.5V@1

### Text on the board
tNames: 9VDC | GND | 5VDC